# EAGLE design amplifier (EAGLE 9.1.3)
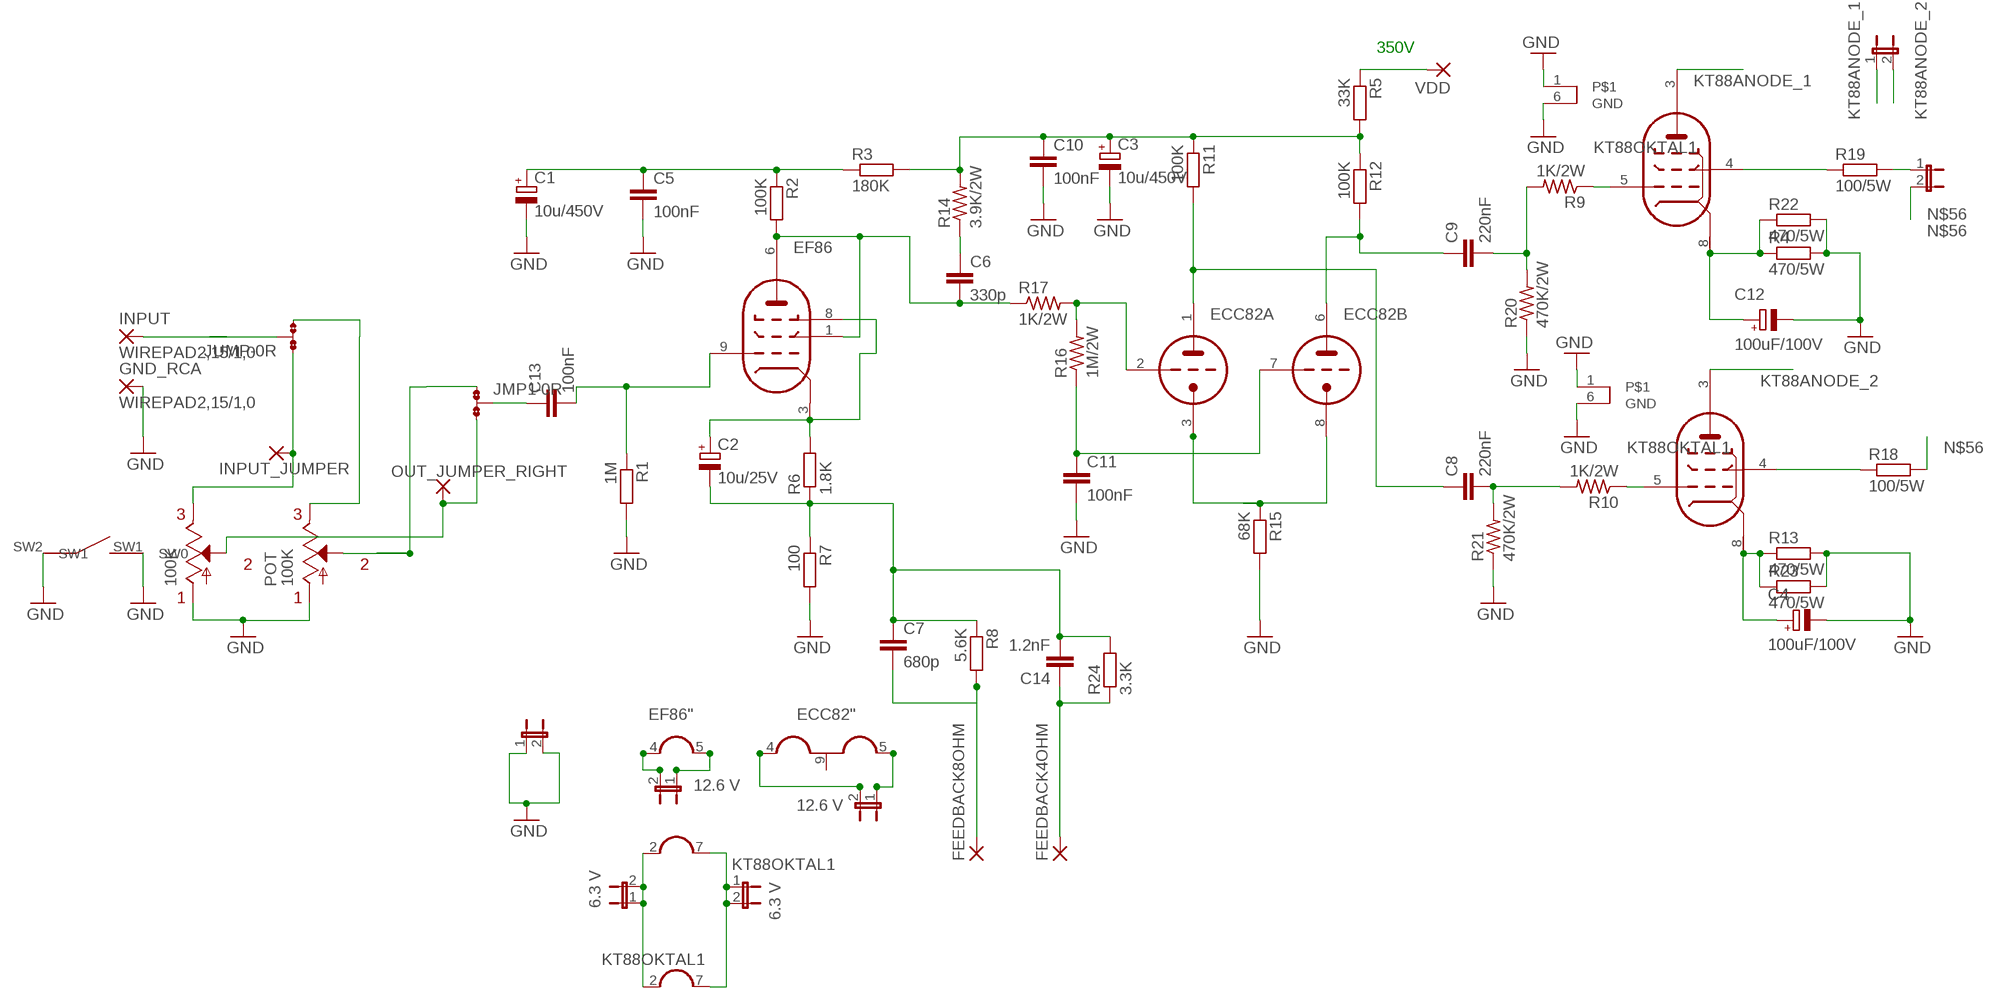
[diagram p0: schematic, sheet 1]

## Parts
6.3_KT88  6.3 V  JP1E  [JP1]
6.3_KTGND  6.3 V  JP1E  [JP1]
12.6_EF86  12.6 V  JP1E  [JP1]
12.6V_ECC82  12.6 V  JP1E  [JP1]
C1  10u/450V  CPOL-EUE5-10.5  [E5-10,5]
C2  10u/25V  CPOL-EUE3.5-10  [E3,5-10]
C3  10u/450V  CPOL-EUE5-10.5  [E5-10,5]
C4  100uF/100V  CPOL-EUE3.5-10  [E3,5-10]
C5  100nF  C7.5/3  [C7.5B3]
C6  330p  C5/5.5  [C5B5.5]
C7  680p  C5/5.5  [C5B5.5]
C8  220nF  C7.5/3  [C7.5B3]
C9  220nF  C7.5/3  [C7.5B3]
C10  100nF  C7.5/3  [C7.5B3]
C11  100nF  C7.5/3  [C7.5B3]
C12  100uF/100V  CPOL-EUE3.5-10  [E3,5-10]
C13  100nF  C-EUC0805K  [C0805K]
C14  1.2nF  C5/5.5  [C5B5.5]
ECC82  ECC82-P  [NOVAL]
EF86  EF86-P  [NOVAL]
FEEDBACK4OHM  2,54/1,1  [2,54/1,1]
FEEDBACK8OHM  2,54/1,1  [2,54/1,1]
GND  JP1E  [JP1]
GND_RCA  WIREPAD2,15/1,0  [2,15/1,0]
INPUT  WIREPAD2,15/1,0  [2,15/1,0]
INPUT_JUMPER  2,54/1,1  [2,54/1,1]
JMP1  0R-JUMPA  [A0R-JMP]
JUMP  0R-JUMPA  [A0R-JMP]
KT88_OUTPUT  JP1E  [JP1]
KT88_TRAFO  JP1E  [JP1]
OUT_JUMPER_RIGHT  2,54/1,1  [2,54/1,1]
POT  100K  DUALPOTAUDIO  [PTR902-2015K-A104]
R1  1M  R-EU_R0805  [R0805]
R2  100K  R-EU_R0805  [R0805]
R3  180K  R-EU_R0805  [R0805]
R4  470/5W  R-EU_0617/5V  [0617V]
R5  33K  R-EU_R0805  [R0805]
R6  1.8K  R-EU_R0805  [R0805]
R7  100  R-EU_R0805  [R0805]
R8  5.6K  R-EU_R0805  [R0805]
R9  1K/2W  R-US_R2512  [R2512]
R10  1K/2W  R-US_R2512  [R2512]
R11  100K  R-EU_R0805  [R0805]
R12  100K  R-EU_R0805  [R0805]
R13  470/5W  R-EU_0617/5V  [0617V]
R14  3.9K/2W  R-US_R2512  [R2512]
R15  68K  R-EU_R0805  [R0805]
R16  1M/2W  R-US_R2512  [R2512]
R17  1K/2W  R-US_R2512  [R2512]
R18  100/5W  R-EU_0817/7V  [P0817V]
R19  100/5W  R-EU_0817/7V  [P0817V]
R20  470K/2W  R-US_R2512  [R2512]
R21  470K/2W  R-US_R2512  [R2512]
R22  470/5W  R-EU_0617/5V  [0617V]
R23  470/5W  R-EU_0617/5V  [0617V]
R24  3.3K  R-EU_R0805  [R0805]
U$2  KT88OKTAL1  [OKTAL1]
U$3  KT88OKTAL1  [OKTAL1]
VDD  2,54/1,1  [2,54/1,1]

## Nets
DIFFOUTPUT_N: C8.1 ECC82.1(A:TA) R11.2
DIFFOUTPUT_P: C9.1 ECC82.6(B:TA) R12.2
ECC82FILL+: 12.6V_ECC82.2 ECC82.4(":H1)
ECC82FILL-: 12.6V_ECC82.1 ECC82.5(":H3)
EF86FILL+: 12.6_EF86.2 EF86.4(H1)
EF86FILL-: 12.6_EF86.1 EF86.5(H2)
GND: C1.- C3.- C4.- C5.2 C10.2 C11.2 C12.- GND.1 GND.2 GND_RCA.1(P) POT.R1_1 POT.R2_1 POT.SW1(SW0) POT.SW2(SW1) R1.2 R4.2 R7.2 R13.2 R15.2 R20.1 R21.1 R22.2 R23.2 U$2.1 U$2.6(KT88:GND) U$3.1 U$3.6(KT88:GND)
KT88ANODE_1: KT88_OUTPUT.1 U$2.3(KT88:ANODE)
KT88ANODE_2: KT88_OUTPUT.2 U$3.3(KT88:ANODE)
KT88FILLAMENT+: 6.3_KT88.1 6.3_KT88.2 U$2.2(H1) U$3.2(H1)
KT88FILLAMENT-: 6.3_KTGND.1 6.3_KTGND.2 U$2.7(H2) U$3.7(H2)
KT88GRID_1: C9.2 R9.2 R20.2
KT88GRID_2: C8.2 R10.2 R21.2
KT88KATHODE_1: C12.+ R4.1 R22.1 U$2.8(KT88:KATHODE)
KT88KATHODE_2: C4.+ R13.1 R23.1 U$3.8(KT88:KATHODE)
N$1: INPUT.1(P) JUMP.2
N$2: C13.2 EF86.9(PG) R1.1
N$3: C2.+ EF86.3(PK) EF86.8(PBG) R6.2
N$4: C6.2 EF86.1(PSG) EF86.6(PA) R2.2 R17.1
N$6: C1.+ C5.1 R2.1 R3.1
N$7: C3.+ C10.1 R3.2 R5.2 R11.1 R12.1 R14.2
N$8: ECC82.2(A:TG) R16.2 R17.2
N$9: C6.1 R14.1
N$10: C2.- C7.1 C14.2 R6.1 R7.1 R8.1 R24.2
N$12: C7.2 FEEDBACK8OHM.1(P) R8.2
N$13: C11.1 ECC82.7(B:TG) R16.1
N$14: C14.1 FEEDBACK4OHM.1(P) R24.1
N$16: R9.1 U$2.5(KT88:INPUT)
N$17: R10.1 U$3.5(KT88:INPUT)
N$20: R18.1 U$3.4(KT88:OUTPUT)
N$21: JMP1.1 POT.R1_2
N$22: JUMP.3 POT.R1_3
N$23: R19.1 U$2.4(KT88:OUTPUT)
N$24: ECC82.3(A:TK) ECC82.8(B:TK) R15.1
N$25: R5.1 VDD.1(P)
N$26: JMP1.3 OUT_JUMPER_RIGHT.1(P) POT.R2_2
N$27: KT88_TRAFO.1 R19.2
N$28: INPUT_JUMPER.1(P) JUMP.1 POT.R2_3
N$35: C13.1 JMP1.2
N$56: KT88_TRAFO.2 R18.2
Unconnected: ECC82.9(":H2)

## Notes on the sheet
- 350V

## Library data of the parts
6.3_KT88 6.3_KTGND 12.6_EF86 12.6V_ECC82 GND KT88_OUTPUT KT88_TRAFO = jumper:JP1E: JUMPER
C1-C4 C12 = rcl:CPOL-EU: POLARIZED CAPACITOR, European symbol; SPICEPREFIX: C
C5-C11 C14 = capacitor-wima:C: CAPACITOR naming: grid - package width
C13 = rcl:C-EU: CAPACITOR, European symbol; SPICEPREFIX: C
ECC82 = Tubes_all:ECC82-P
EF86 = Tubes_all:EF86-P
FEEDBACK4OHM FEEDBACK8OHM INPUT_JUMPER OUT_JUMPER_RIGHT VDD = wirepad:2,54/1,1: THROUGH-HOLE PAD
GND_RCA INPUT = wirepad:WIREPAD: Wire PAD connect wire on PCB
JMP1 JUMP = jump-0r-smd:0R-JUMP: SMD 0R 0805 Jumper
POT = Bourns:DUALPOTAUDIO: Dual audio potentiometer with switch.
R1-R3 R5-R8 R11 R12 R15 R18 R19 R24 = rcl:R-EU_: RESISTOR, European symbol; SPICEPREFIX: R
R4 R13 R22 R23 = resistor_mod:R-EU_: RESISTOR, European symbol
R9 R10 R14 R16 R17 R20 R21 = resistor:R-US_: RESISTOR, American symbol
U$2 U$3 = tubes_stockes:KT88

## Board
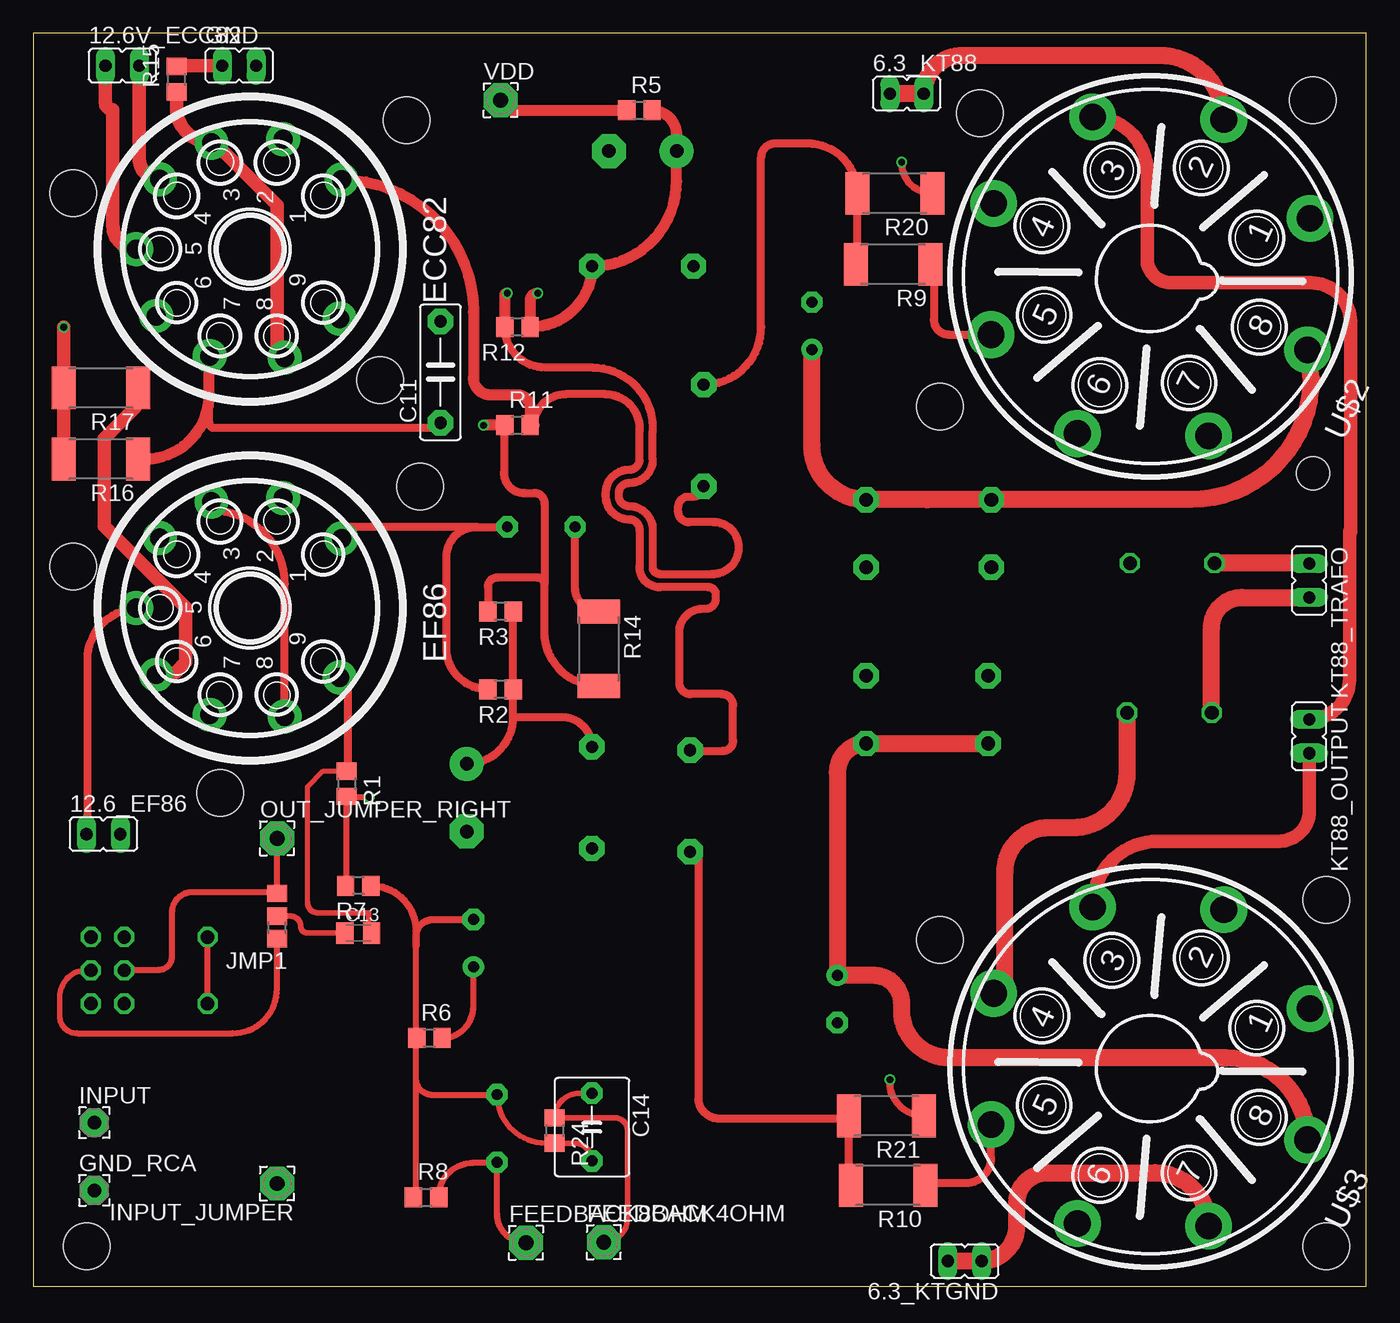
[diagram p1: board, top side]
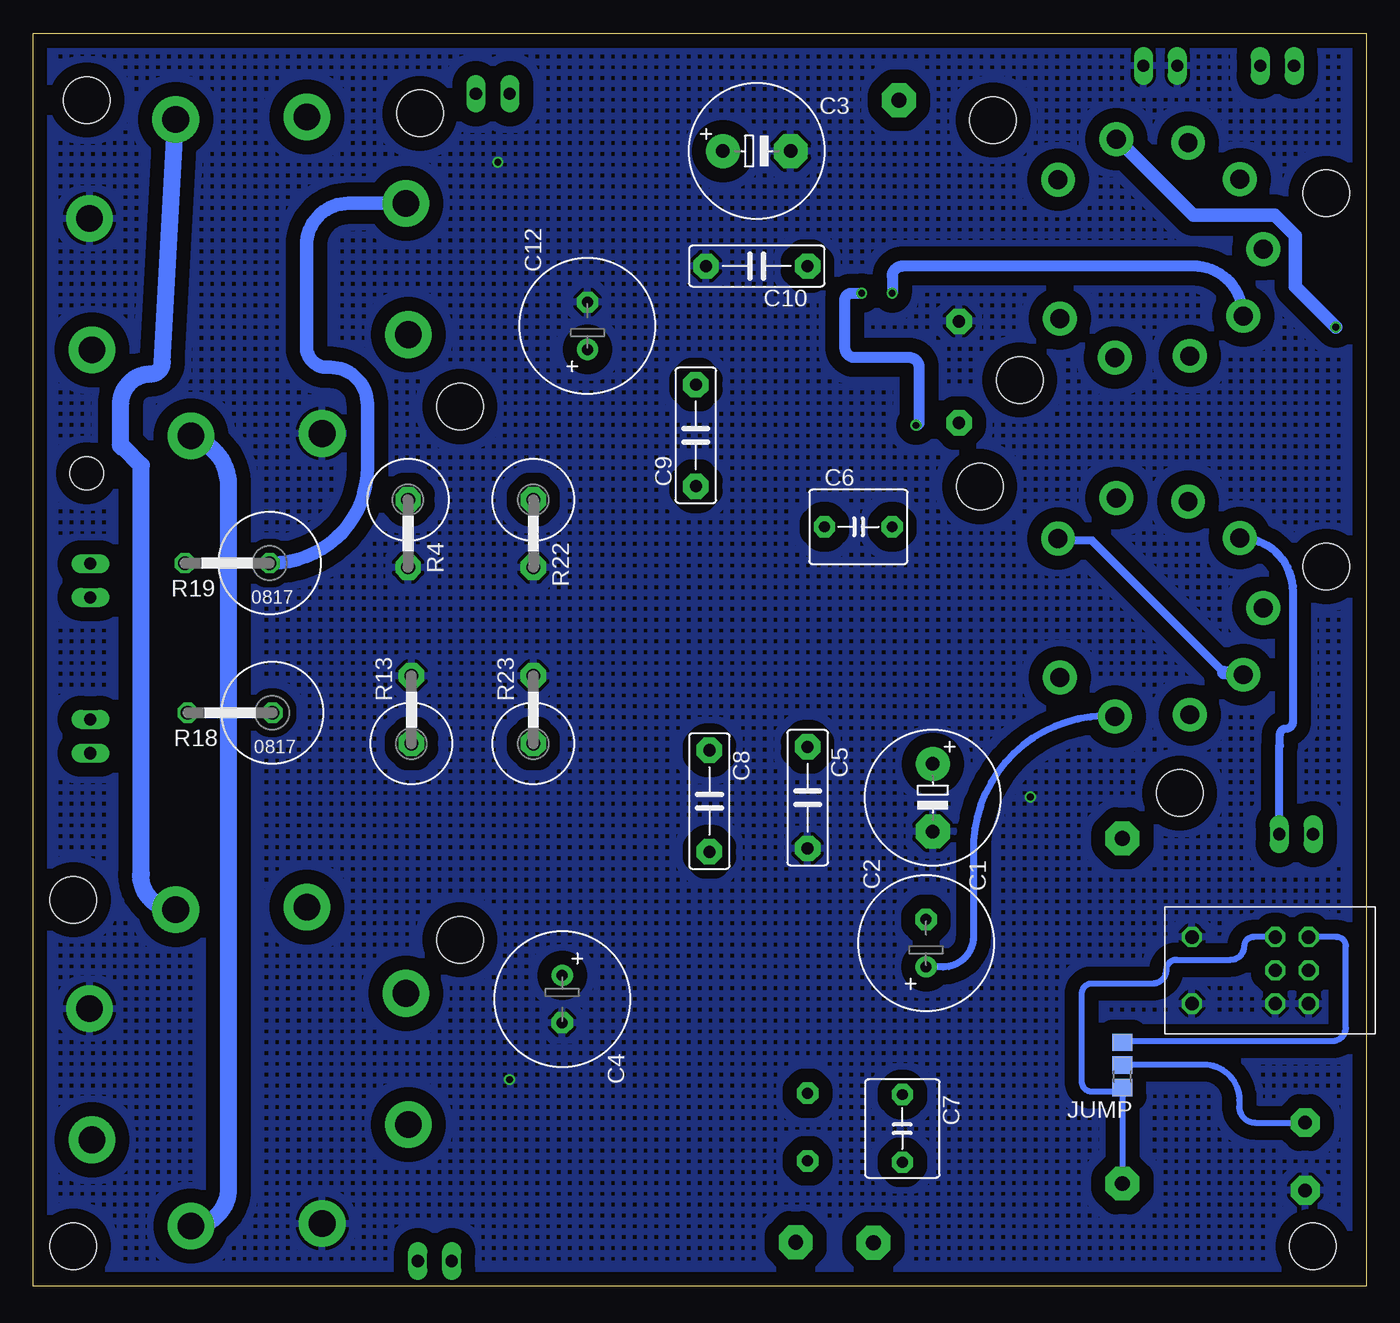
[diagram p2: board, bottom side, seen from below]

Size 100 x 94 mm. Coordinates in mm from the lower left corner, seen from the top.
Outline: 0,0 100,0 100,94 0,94 0,0
Copper layers (1*16): Top 0.035mm / dielectric 1.5mm / Bottom 0.035mm
Design rules "SeeedStudio_2layer_DRU_no_angle_20140221": minimum track width 6mil, minimum drill 12mil, track to track 6mil, track to pad 6mil, pad to pad 6mil, via to via 6mil, smd to smd 0mil, copper to edge 10mil, drill to drill 10mil, minimum pad ring 10mil, minimum via ring 6mil, stop-mask expansion 2mil, vias tented up to drill 100mil, thermal gap 10mil
Holes 3.5 mm at 28,87.5 96,89 97,3 4,3 68,66 71,88 68,26 97,29 3,54 14,37 29,60 3,82 26,68
Holes 2.5 mm at 96,61

### Footprints (pad centres in the part's own frame; a part is rotated, then mirrored left to right if it is on the bottom)
JP1 = drill 0.914 long: 1 0,-1.27; 2 0,1.27
E5-10,5 = drill 1.016 pad 2.54: + -2.54,0 | drill 1.016 pad 2.54 octagon: - 2.54,0
E3,5-10 = drill 0.813 pad 1.6: + -1.778,0 | drill 0.813 pad 1.6 octagon: - 1.778,0
C7.5B3 = drill 0.914 pad 1.905 octagon: 1 -3.81,0; 2 3.81,0
C5B5.5 = drill 0.813 pad 1.6 octagon: 1 -2.54,0; 2 2.54,0
C0805K = smd 1.3 x 1.6: 1 -1,0; 2 1,0
NOVAL = drill 1.422 pad 2.54: 1 5.207,-6.858; 2 8.254,-2.484; 3 8.004,2.893; 4 5.258,6.77; 5 0,8.524; 6 -5.004,7.024; 7 -8.004,3.02; 8 -8.127,-2.611; 9 -5.207,-6.731
2,54/1,1 = drill 1.118 pad 2.54 octagon: 1 0,0
2,15/1,0 = drill 1.016 pad 2.159 octagon: 1 0,0
A0R-JMP = smd 1.5 x 1.3: 1 0,1.7; 2 0,0; 3 0,-1.7
PTR902-2015K-A104 = drill 1 octagon: R1_1 -2.5,0; R1_2 0,0; R1_3 2.5,0; R2_1 -2.5,2.5; R2_2 0,2.5; R2_3 2.5,2.5; SW1 -2.5,8.75; SW2 2.5,8.75
R0805 = smd 1.3 x 1.5: 1 -0.95,0; 2 0.95,0
0617V = drill 1.016 pad 1.905 octagon: 1 -2.54,0; 2 2.54,0
R2512 = smd 1.8 x 3.2: 1 -2.8,0; 2 2.8,0
P0817V = drill 1.016 octagon: 1 -5.08,0; 2 1.27,0
OKTAL1 = drill 2 pad 3.5: 1 9,-9; 2 13,0; 3 9,9; 4 0,13; 5 -9,9; 6 -13,0; 7 -9,-9; 8 0,-13

### Placement (x,y rotation side)
6.3_KT88  65.53,89.47 270 top
6.3_KTGND  69.88,1.89 90 top
12.6_EF86  5.26,33.91 270 top
12.6V_ECC82  6.68,91.57 270 top
C1  32.51,36.65 270 bottom
C2  33.02,25.73 90 bottom
C3  45.72,85.17 0 bottom
C4  60.33,21.54 270 bottom
C5  41.91,36.65 270 bottom
C6  38.1,56.97 0 bottom
C7  34.8,11.83 270 bottom
C8  49.28,36.4 270 bottom
C9  50.29,63.83 90 bottom
C10  45.72,76.53 180 bottom
C11  30.55,68.58 90 top
C12  58.42,72.06 90 bottom
C13  24.38,26.49 0 top
C14  41.91,11.94 270 top
ECC82  16.26,77.8 90 top
EF86  16.26,50.88 90 top
FEEDBACK4OHM  42.8,3.3 0 top
FEEDBACK8OHM  36.96,3.25 0 top
GND  15.45,91.57 270 top
GND_RCA  4.57,7.19 0 top
INPUT  4.57,12.27 0 top
INPUT_JUMPER  18.29,7.7 180 top
JMP1  18.29,27.76 180 top
JUMP  18.29,16.59 180 bottom
KT88_OUTPUT  95.72,41.26 180 top
KT88_TRAFO  95.72,52.94 180 top
OUT_JUMPER_RIGHT  18.29,33.61 0 top
POT  4.32,23.7 90 bottom
R1  23.52,37.7 270 top
R2  35.05,44.78 180 top
R3  35.05,50.62 180 top
R4  71.88,56.47 270 bottom
R5  45.47,88.22 0 top
R6  29.72,18.62 0 top
R7  24.38,30.05 180 top
R8  29.46,6.68 0 top
R9  64.52,76.66 180 top
R10  64.14,7.57 180 top
R11  36.32,64.59 0 top
R12  36.32,71.96 180 top
R13  71.63,43.26 90 bottom
R14  42.42,47.83 270 top
R15  10.75,90.55 90 top
R16  5.08,62.05 180 top
R17  5.08,67.39 180 top
R18  87.15,43.03 180 bottom
R19  87.35,54.25 180 bottom
R20  64.64,81.99 180 top
R21  64.01,12.78 180 top
R22  62.48,56.47 270 bottom
R23  62.48,43.26 90 bottom
R24  39.12,11.68 270 top
U$2  83.82,75.75 65 top
U$3  83.82,16.47 65 top
VDD  35.05,88.98 0 top

### Tracks (layer width: path | path; a pad name or v marks a point on that pad's centre or on a via)
DIFFOUTPUT_N
  Top 0.61: 37.59,64.59 arc-90 39.92,66.93 42.93,66.93 arc-90 45.48,64.37 45.48,64.12 45.48,62.03 arc-90 44.7,61.25 arc90 42.93,59.48 42.93,59.31 arc90 44.7,57.53 arc-90 45.48,56.75 45.48,53.96 arc90 46.99,52.45 50.65,52.45 arc-90 51.21,51.89 51.21,51.59 arc-90 50.44,50.83 50.22,50.83 arc90 48.46,49.07 48.46,45.26 arc90 49.3,44.42 51.66,44.42 arc-90 52.5,43.59 52.5,40.92 arc-90 51.74,40.16 49.33,40.16 | 49.33,40.16 arc-90 C8.1 arc90 49.33,40.16
  Top 0.813: ECC82.1 arc-90 33.02,73.1 33.02,68.15 arc90 34.29,66.88 36.32,66.88 arc-90 37.27,65.93 R11.2 37.59,64.59
DIFFOUTPUT_P  (via drill 0.51 pad 0.41)
  Top 0.61: R12.2 arc90 38.4,68.93 41.91,68.93 arc-90 46.47,64.37 46.47,64.12 46.47,62.03 arc-90 44.7,60.26 arc90 43.92,59.48 43.92,59.31 arc90 44.7,58.53 arc-90 46.47,56.75 46.47,53.96 arc90 46.99,53.44 50.95,53.44 arc90 52.94,55.42 arc90 51.03,57.33 49.16,57.33 arc-90 48.38,58.11 48.38,58.46 arc-90 49.16,59.24 49.51,59.24 arc90 C9.1
  Top 0.813: v35.56,74.5 arc90 35.37,74.31 R12.2
  Bottom 0.813: v35.56,74.5 35.56,75.77 arc90 34.8,76.53 17.53,76.53 12.97,76.53 arc90 ECC82.6
ECC82FILL+
  Top 1.016: ECC82.4 arc-90 7.95,84.59 12.6V_ECC82.2
ECC82FILL-
  Top 1.016: ECC82.5 arc-90 5.97,79.56 5.97,88.27 arc-90 5.41,88.82 12.6V_ECC82.1
EF86FILL+
  Bottom 0.61: EF86.4 arc90 5.49,52.14 5.49,42.37 arc90 6.02,41.83 arc-90 6.48,41.38 6.48,40.54 arc-90 6.53,40.49 12.6_EF86.2
EF86FILL-
  Top 0.61: 4.06,33.99 4.06,46.99 arc-90 7.95,50.88
  Top 1.016: 12.6_EF86.1 arc90 4.06,33.99 | 7.95,50.88 EF86.5
GND  (via drill 0.51)
  Top 0.457: POT.SW1 POT.SW2 | R7.2 23.52,30.14 R1.2 23.55,36.71 v25.2,36.71
  Top 0.508: R21.1 arc-90 64.26,15.32 v64.26,15.49 | R20.1 arc-90 65.15,84.28 v65.15,84.33
  Top 1.016: R15.2 arc-90 10.81,91.57 GND.1
  pour Bottom (isolate 1.05, rank 2, hatched): 0,92.79 0,-0.24 100.08,-0.24 100.08,92.49 100.08,92.79
KT88ANODE_1
  Top 1.016: U$2.3 arc-90 83.57,83.61 83.57,77.07 arc90 85.34,75.3 89.76,75.3 arc90 89.77,75.29 95.86,75.29 arc-90 98.83,72.31 98.83,56.62 arc90 98.75,56.54 98.75,45.56 arc-90 KT88_OUTPUT.1
KT88ANODE_2
  Top 1.016: U$3.3 arc-90 84.42,33.39 93.47,33.39 arc90 95.72,35.64 KT88_OUTPUT.2
KT88FILLAMENT+
  Top 1.27: U$2.2 arc90 84.52,92.33 69.66,92.33 arc90 6.3_KT88.2 6.3_KT88.1
  Bottom 1.27: U$3.2 arc90 91.95,30.89 arc-90 91.9,30.94 91.9,61.57 93.27,62.94 arc90 93.47,63.14 93.47,66.15 arc90 91.19,68.44 arc-90 90.33,69.29 U$2.2
KT88FILLAMENT-
  Top 1.27: 6.3_KTGND.2 6.3_KTGND.1 arc90 73.79,4.53 73.79,6.22 arc-90 76.07,8.51 84.17,8.51 arc-90 U$3.7
  Bottom 1.27: U$3.7 arc-90 85.34,7.34 85.34,60.06 arc-90 89.08,63.79 U$2.7
KT88GRID_1
  Top 0.61: R9.2 arc90 61.84,76.79 61.84,77.22 R20.2 arc90 58.11,85.72 55.63,85.72 arc90 54.61,84.71 54.61,71.96 arc-90 C9.2
KT88GRID_2
  Top 0.61: R10.2 arc-90 61.21,7.7 R21.2 arc-90 61,12.57 51.44,12.57 arc-90 49.91,14.1 49.91,31.95 arc90 C8.2
KT88KATHODE_1
  Top 1.016: R4.1 arc-90 71.92,59.04
  Top 1.27: R4.1 67.06,59.01 R22.1 arc-90 58.42,63.07 C12.+ | U$2.8 95.89,68.06 arc-90 86.87,59.04 71.92,59.04
KT88KATHODE_2
  Top 1.27: R13.1 R23.1 arc90 60.33,38.56 C4.+ 63.04,23.32 arc-90 65.15,21.21 65.15,20.7 arc90 68.71,17.14 89.43,17.14 arc-90 89.45,17.13 arc-90 U$3.8
N$1
  Bottom 0.457: JUMP.2 arc90 18.24,16.64 12.19,16.64 arc90 9.53,13.97 9.53,13.46 arc-90 8.33,12.27 INPUT.1
N$2
  Top 0.381: 20.57,28.78 20.57,37.47 21.75,38.65 R1.1
  Top 0.406: C13.2 25.15,26.73 25.15,28.02 21.34,28.02 arc-90 20.57,28.78
  Top 0.61: 23.62,38.77 23.62,45.29
  Top 1.016: 23.62,45.29 EF86.9 | 23.62,38.77 R1.1
N$3
  Top 0.457: R6.2 arc90 33.02,20.97 C2.+
  Top 0.61: EF86.8 18.87,52.69 arc90 13.36,58.2 EF86.3
  Bottom 0.508: EF86.8 arc-90 29.46,33.42 29.46,26.24 arc90 31.75,23.95 C2.+
N$4
  Top 0.61: R2.2 arc-90 30.99,47.9 30.99,54.69 arc-90 33.27,56.97 | 33.27,56.97 C6.2 | EF86.1 arc-90 24,56.97 33.27,56.97
  Top 1.016: R17.1 7.62,67.39 7.62,65.86 5.33,63.58 5.33,57.02 11.43,50.93 11.43,46.81 10.67,46.05 EF86.6
  Bottom 0.61: 10.67,46.05 20.57,55.96 22.99,55.96 arc90 EF86.1
  Bottom 1.016: 10.67,46.05 EF86.6
N$6
  Top 0.61: C1.+ arc90 36,42.68 | 36,42.68 R2.1 R3.1 | C5.1 arc90 39.69,42.68 36,42.68
N$7  (via drill 0.51)
  Top 0.61: R14.2 arc-90 38.35,49.09 38.35,52.66 | 38.35,52.66 arc90 37.85,53.16 34.8,53.16 arc90 34.1,52.47 R3.2 | R11.1 arc90 35.31,64.53 35.31,61.04 arc90 36.83,59.51 37.59,59.51 arc-90 38.35,58.75 38.35,52.66
  Top 0.813: R5.2 arc-90 48.26,86.37 C3.+ 48.26,82.88 arc-90 C10.1 arc-90 37.34,71.96 R12.1 37.27,73.93 arc-90 v37.85,74.5 | R11.1 v33.78,64.59
  Bottom 0.813: v33.78,64.59 arc-90 33.53,64.85 33.53,68.91 arc-90 34.29,69.67 38.35,69.67 arc90 39.12,70.44 39.12,73.99 arc90 38.61,74.5 v37.85,74.5
N$8  (via drill 0.51)
  Top 1.016: R17.2 R16.2 | v2.29,71.96 R17.2 | R17.2
  Bottom 1.016: v2.29,71.96 5.33,75.01 5.33,78.82 6.86,80.34 12.95,80.34 18.29,85.68 ECC82.2
N$9
  Top 0.61: R14.1 arc-90 40.64,52.41 C6.1
N$10
  Top 0.305: 28.7,18.69 arc90 R6.1
  Top 0.406: C7.1 arc90 38.43,10.73 38.86,10.73 | 38.86,10.73 R24.2 | C14.2 arc90 40.57,10.73 38.86,10.73
  Top 0.457: C7.1 arc-90 34.76,14.34 29.97,14.34 arc-90 28.7,15.61 28.7,18.4 | 28.7,18.4 28.7,18.69 28.7,25.48 | R8.1 arc90 28.7,6.87 28.7,18.4
  Top 0.508: C2.- 29.97,27.51 arc90 28.7,26.24 28.7,25.48 28.7,26.68 arc90 R7.1
N$12
  Top 0.457: FEEDBACK8OHM.1 arc-90 34.8,5.41 C7.2 33.02,9.29 arc90 32.99,9.26 arc90 R8.2
N$13
  Top 0.61: C11.1 arc-90 30.17,64.39 13.59,64.39 arc-90 13.21,64.77 13.21,66.93
  Top 0.813: R16.1 8.33,62.05 arc90 13.21,66.93 13.21,69.77 arc-90 ECC82.7
N$14
  Top 0.406: C14.1 40.96,14.48 arc90 R24.1 43.63,12.63 arc-90 44.58,11.68 44.58,5.08 arc-90 FEEDBACK4OHM.1
N$16
  Top 0.61: R9.1 arc-90 67.56,76.41 67.56,72.52 arc90 68.68,71.4 U$2.5
N$17
  Top 0.61: R10.1 arc-90 67.11,7.75 69.98,7.75 arc90 71.86,9.63 U$3.5
N$20
  Top 1.27: U$3.4 arc90 72.9,22.82 72.9,31.1 arc-90 76.2,34.4 77.98,34.4 arc90 82.07,38.49 R18.1
N$21
  Top 0.406: POT.R1_2 3.96,23.7 arc90 1.98,21.72 1.98,20.27 arc90 3.28,18.97
  Top 0.457: JMP1.1 18.29,22.31 arc-90 14.95,18.97 3.28,18.97
N$22
  Bottom 0.457: POT.R1_3 2.21,26.2 arc90 1.52,25.51 1.52,19.42 arc90 2.54,18.4 18.18,18.4 arc-90 JUMP.3
N$23
  Bottom 1.016: U$2.4 76.34,81.25 arc-90 79.5,78.09 79.5,70.47 arc-90 77.98,68.95 77.72,68.95 arc90 74.93,66.15 74.93,61.44 arc90 82.12,54.25 R19.1
N$24
  Top 1.016: ECC82.8 18.29,70.44 18.29,81.1 13.72,85.68 ECC82.3 arc-90 10.75,88.42 R15.1
N$25
  Top 0.813: VDD.1 arc90 35.81,88.22 R5.1
N$26
  Top 0.381: JMP1.3 18.29,29.58 18.29,29.8
  Top 0.457: 18.29,29.8 OUT_JUMPER_RIGHT.1 | POT.R2_2 arc-90 6.85,23.73 9.4,23.73 arc90 10.41,24.75 10.41,28.05 arc-90 11.94,29.58 18.29,29.58
N$27
  Top 1.27: KT88_TRAFO.1 arc90 95.69,54.25 R19.2
N$28
  Bottom 0.457: INPUT_JUMPER.1 JUMP.1 arc90 18.59,14.59 20.57,14.59 arc90 21.34,15.35 21.34,21.96 arc90 20.57,22.72 16,22.72 arc-90 14.99,23.73 arc90 14.22,24.5 10.16,24.5 arc-90 9.14,25.51 arc90 8.46,26.2 POT.R2_3
N$35
  Top 0.406: JMP1.2 19.3,27.76 arc-90 20.07,27 arc90 20.57,26.49 C13.1
N$56
  Top 1.27: KT88_TRAFO.2 90.68,51.67 arc90 88.39,49.39 88.39,43.05 arc90 R18.2

### Text on the board
tsilk: 6.3V KT88+ | VDD | R15 | GND | R5 | 12.6V_ECC82 | 3 | 2 | 3 | 2 | 4 | 1 | ECC82 | R20 | 4 | 1 | 5 | 6 | 9 | R9 | 7 | 8 | 5 | R12 | 8 | 6 | 7 | R11 | R17 | R16 | KT88 Grid | 3 | 2 | 4 | 1 | 5 | R3 | R14 | Tosis V1.2 | 6 | 9 | 8 | 7 | R2 | EF86 | OUT_JUMPER_RIGHT | R1 | KT88 Anode | R7 | 12.6_EF86 | C13 | 2 | 3 | R6 | 4 | 1 | R24 | 5 | INPUT | 8 | R21 | R8 | 7 | GND_RCA | 6 | R10 | INPUT_JUMPER | 6.3_KT88 - | FEEDBACK 8OHM | FEEDBACK 4OHM
bsilk: C3 | C12 | C10 | C11 | C6 | C9 | R22 | R4 | R19 | R18 | R23 | R13 | C5 | C8 | C1 | C2 | C4 | C14 | C7